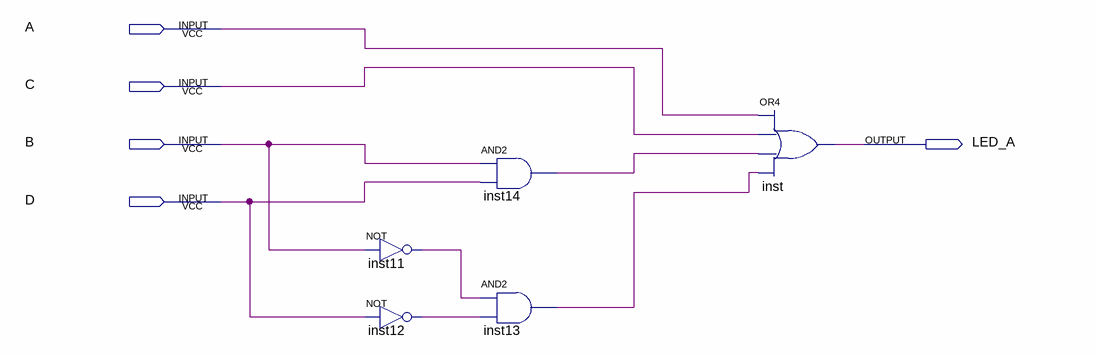
[diagram p0: schematic sheet]
// Quartus schematic led_a.bdf as structural Verilog: 5 symbols, 5 pins
module led_a (
  input  A,
  input  C,
  input  B,
  input  D,
  output LED_A
);

  wire inst11_out, inst12_out, inst13_out, inst14_out;

  not inst11 (inst11_out, B);
  not inst12 (inst12_out, D);
  and inst14 (inst14_out, B, D);
  and inst13 (inst13_out, inst11_out, inst12_out);
  or inst (LED_A, A, C, inst14_out, inst13_out);
endmodule
